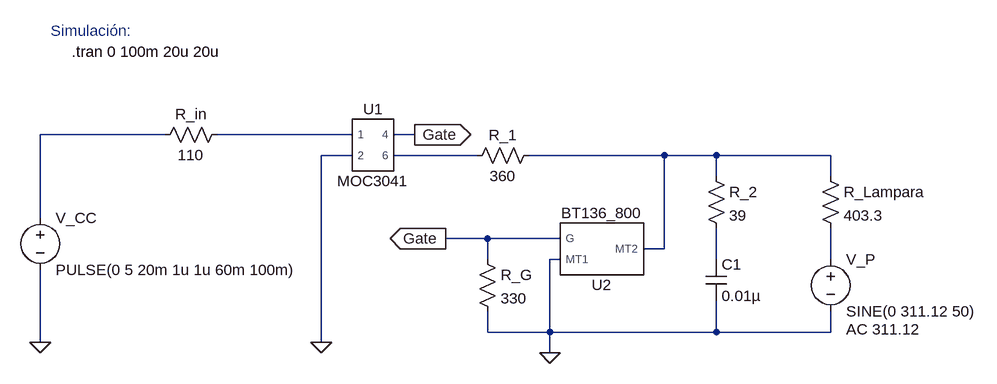
[diagram p0: schematic TPT9 - Placa de Control de un Semáforo.asc]
TPT9 - Placa de Control de un Semáforo.asc, the LTspice schematic file:
Version 4
SHEET 1 2684 680
WIRE -16 128 -208 128
WIRE 272 128 64 128
WIRE 368 128 336 128
WIRE 272 160 224 160
WIRE 464 160 336 160
WIRE 752 160 544 160
WIRE 832 160 752 160
WIRE 1008 160 832 160
WIRE 832 192 832 160
WIRE 1008 192 1008 160
WIRE -208 256 -208 128
WIRE 480 288 416 288
WIRE 592 288 480 288
WIRE 752 304 752 160
WIRE 752 304 720 304
WIRE 480 320 480 288
WIRE 592 320 576 320
WIRE 832 320 832 272
WIRE 1008 320 1008 272
WIRE 480 432 480 400
WIRE 576 432 576 320
WIRE 576 432 480 432
WIRE 832 432 832 384
WIRE 832 432 576 432
WIRE 1008 432 1008 400
WIRE 1008 432 832 432
WIRE -208 448 -208 336
WIRE 224 448 224 160
WIRE 576 464 576 432
FLAG 224 448 0
FLAG -208 448 0
FLAG 576 464 0
FLAG 368 128 Gate
IOPIN 368 128 Out
FLAG 416 288 Gate
IOPIN 416 288 Out
SYMBOL res 80 112 R90
WINDOW 0 0 56 VBottom 2
WINDOW 3 32 56 VTop 2
SYMATTR InstName R_in
SYMATTR Value 110
SYMBOL voltage -208 240 R0
WINDOW 123 0 0 Left 0
WINDOW 39 0 0 Left 0
SYMATTR InstName V_CC
SYMATTR Value PULSE(0 5 20m 1u 1u 60m 100m)
SYMBOL res 560 144 R90
WINDOW 0 0 56 VBottom 2
WINDOW 3 32 56 VTop 2
SYMATTR InstName R_1
SYMATTR Value 360
SYMBOL res 464 304 R0
SYMATTR InstName R_G
SYMATTR Value 330
SYMBOL cap 816 320 R0
SYMATTR InstName C1
SYMATTR Value 0.01µ
SYMBOL res 816 176 R0
SYMATTR InstName R_2
SYMATTR Value 39
SYMBOL res 992 176 R0
SYMATTR InstName R_Lampara
SYMATTR Value 403.3
SYMBOL voltage 1008 304 R0
WINDOW 123 24 124 Left 2
WINDOW 39 0 0 Left 0
SYMATTR Value2 AC 311.12
SYMATTR InstName V_P
SYMATTR Value SINE(0 311.12 50)
SYMBOL MOC3041 304 144 R0
SYMATTR InstName U1
SYMBOL BT136_800 656 304 R180
SYMATTR InstName U2
TEXT -192 -32 Left 2 ;Simulación:
TEXT -160 0 Left 2 !.tran 0 100m 20u 20u

The netlist it stands for:
* TPT9 - Placa de Control de un Semáforo.asc
R_in N002 N001 110
V_CC N001 0 PULSE(0 5 20m 1u 1u 60m 100m)
R_1 N004 N003 360
R_G Gate 0 330
C1 N005 0 0.01µ
R_2 N004 N005 39
R_Lampara N004 N006 403.3
V_P N006 0 SINE(0 311.12 50) AC 311.12
XU1 N002 0 Gate N003 MOC3041  ; pins 1 2 4 6
XU2 N004 0 Gate BT136_800  ; pins MT2 MT1 G
* Simulación:
.tran 0 100m 20u 20u
.lib C:\Users\Ernesto\Desktop\MOC3041.lib
.lib C:\Users\Ernesto\Desktop\BT136_800.lib
.backanno
.end